# EAGLE design SOT-23-5 Breakout Board (EAGLE 7.7.0)
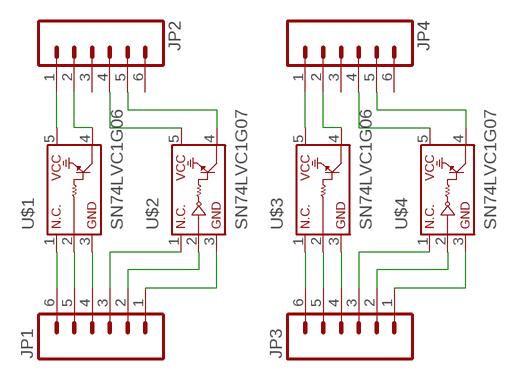
[diagram p0: schematic, sheet 1]

## Parts
JP1  M06  [1X06]
JP2  M06  [1X06]
JP3  M06  [1X06]
JP4  M06  [1X06]
U$1  SN74LVC1G06  [SOT-23-5]
U$2  SN74LVC1G07  [SOT-23-5]
U$3  SN74LVC1G06  [SOT-23-5]
U$4  SN74LVC1G07  [SOT-23-5]

## Nets
N$1: JP2.1 U$1.5
N$2: JP2.2 U$1.4
N$3: JP2.4 U$2.5
N$4: JP2.5 U$2.4
N$5: JP1.6 U$1.1
N$6: JP1.5 U$1.2
N$7: JP1.4 U$1.3
N$8: JP1.3 U$2.1
N$9: JP1.2 U$2.2
N$10: JP1.1 U$2.3
N$11: JP4.1 U$3.5
N$12: JP4.2 U$3.4
N$13: JP4.4 U$4.5
N$14: JP4.5 U$4.4
N$15: JP3.6 U$3.1
N$16: JP3.5 U$3.2
N$17: JP3.4 U$3.3
N$18: JP3.3 U$4.1
N$19: JP3.2 U$4.2
N$20: JP3.1 U$4.3
Unconnected: JP2.3 JP2.6 JP4.3 JP4.6

## Library data of the parts
JP1-JP4 = HyTechDevices:M06: Standard 6-pin 0.1" header. NOTES ON THE VARIANTS LOCK and LOCK_LONGPADS... This footprint was designed to help hold the alignment of a through-hole component (i.e. 6-pin header) while soldering it into place. You may notice that each hole has been shifted either up or down by 0.005 of an inch from it's more standard position (which is a perfectly straight line). This slight alteration caused the pins (the squares in the middle) to touch the edges of the holes. Because they are alternating, it causes a "brace" to hold the component in place. 0.005 has proven to be the perfect amount of "off-center" position when using our standard breakaway headers. Although looks a little odd when you look at the bare footprint, once you have a header in there, the alteration is very hard to notice. Also,if you push a header all the way into place, it is covered up entirely on the bottom side. This idea of altering the position of holes to aid alignment will be further integrated into the Sparkfun Library for other footprints. It can help hold any component with 3 or more connection pins. Note: The Sparkfun version includes many other packages including surface mount that may be of future interest. Source: Sparkfun <https://github.com/sparkfun/SparkFun-Eagle-Libraries>
U$1 U$3 = HyTechDevices:SN74LVC1G06: TI SN74LVC1G06 Single Inverter Buffer/Driver With Open-Drain Output Datasheet <http://www.ti.com/lit/ds/symlink/sn74lvc1g06.pdf>
U$2 U$4 = HyTechDevices:SN74LVC1G07: TI SN74LVC1G07 Single Buffer/Driver With Open-Drain Output Datasheet <http://www.ti.com/lit/ds/symlink/sn74lvc1g07.pdf>

## Board
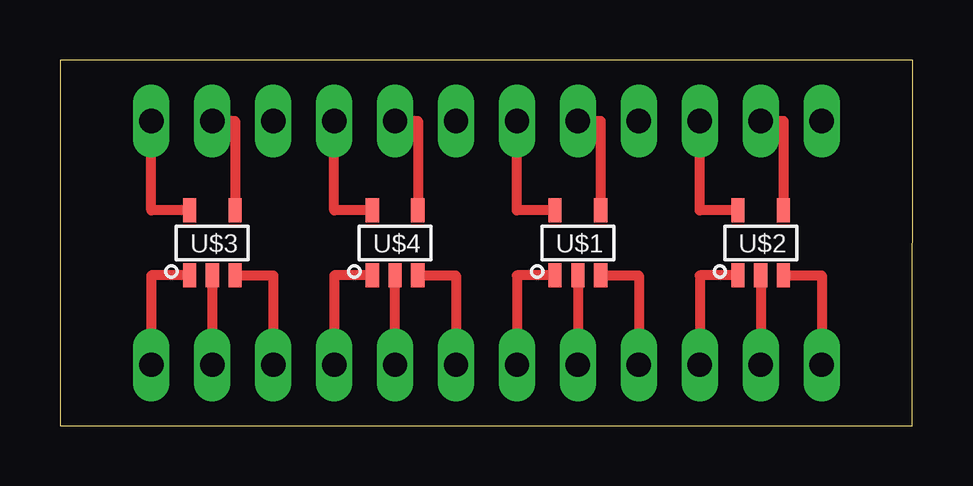
[diagram p1: board, top side]
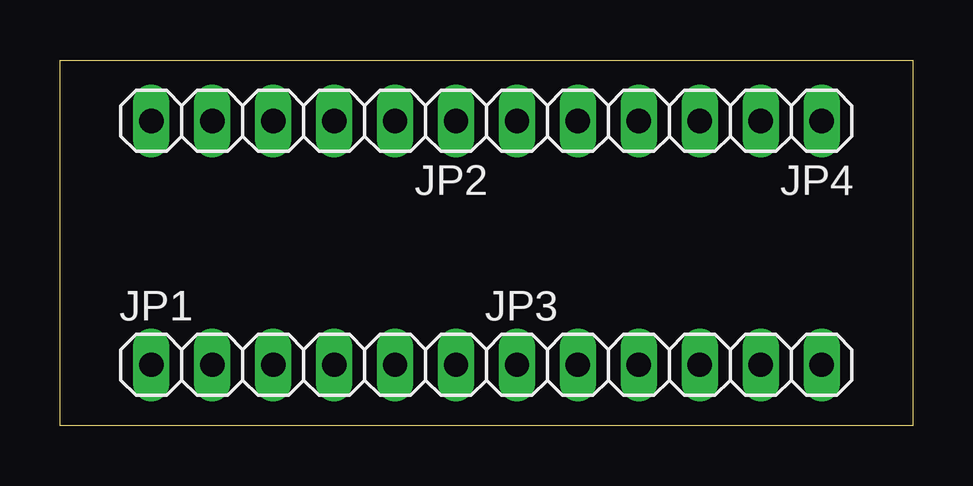
[diagram p2: board, bottom side, seen from below]

Size 35.56 x 15.24 mm. Coordinates in mm from the lower left corner, seen from the top.
Outline: 0,0 35.54,0 35.56,15.24 0,15.24 0,0
Copper layers (1*16): Top 0.035mm / dielectric 1.5mm / Bottom 0.035mm
Design rules "default": minimum track width 10mil, minimum drill 24mil, track to track 8mil, track to pad 8mil, pad to pad 8mil, via to via 8mil, smd to smd 8mil, copper to edge 40mil, drill to drill 8mil, minimum pad ring 10mil, minimum via ring 8mil, stop-mask expansion 4mil, vias tented up to drill 0mil, thermal gap 10mil

### Footprints (pad centres in the part's own frame; a part is rotated, then mirrored left to right if it is on the bottom)
1X06 = drill 1.016 long: 1 -6.35,0; 2 -3.81,0; 3 -1.27,0; 4 1.27,0; 5 3.81,0; 6 6.35,0
SOT-23-5 = smd 1 x 0.55: 1 -1.35,0.95; 2 -1.35,0; 3 -1.35,-0.95; 4 1.35,-0.95; 5 1.35,0.95

### Placement (x,y rotation side)
JP1  25.4,2.54 0 bottom
JP2  25.4,12.7 180 bottom
JP3  10.16,2.54 0 bottom
JP4  10.16,12.7 180 bottom
U$1  21.59,7.62 90 top
U$2  29.21,7.62 90 top
U$3  6.35,7.62 90 top
U$4  13.97,7.62 90 top

### Tracks (layer width: path | path; a pad name or v marks a point on that pad's centre or on a via)
N$1
  Top 0.406: U$1.5 19.05,8.97 JP2.1
N$2
  Top 0.406: JP2.2 22.54,12.7 U$1.4
N$3
  Top 0.406: U$2.5 26.67,8.97 JP2.4
N$4
  Top 0.406: JP2.5 30.16,12.7 U$2.4
N$5
  Top 0.406: U$1.1 19.05,6.27 JP1.6
N$6
  Top 0.406: U$1.2 JP1.5
N$7
  Top 0.406: U$1.3 24.13,6.27 JP1.4
N$8
  Top 0.406: U$2.1 26.67,6.27 JP1.3
N$9
  Top 0.406: U$2.2 JP1.2
N$10
  Top 0.406: U$2.3 31.75,6.27 JP1.1
N$11
  Top 0.406: U$3.5 3.81,8.97 JP4.1
N$12
  Top 0.406: JP4.2 7.3,12.7 U$3.4
N$13
  Top 0.406: U$4.5 11.43,8.97 JP4.4
N$14
  Top 0.406: JP4.5 14.92,12.7 U$4.4
N$15
  Top 0.406: U$3.1 3.81,6.27 JP3.6
N$16
  Top 0.406: U$3.2 JP3.5
N$17
  Top 0.406: U$3.3 8.89,6.27 JP3.4
N$18
  Top 0.406: U$4.1 11.43,6.27 JP3.3
N$19
  Top 0.406: JP3.2 U$4.2
N$20
  Top 0.406: U$4.3 16.51,6.27 JP3.1

### Text on the board
tDocu: HyTech Racing | SOT-23-5